# EAGLE design motordriver (EAGLE 5.10)
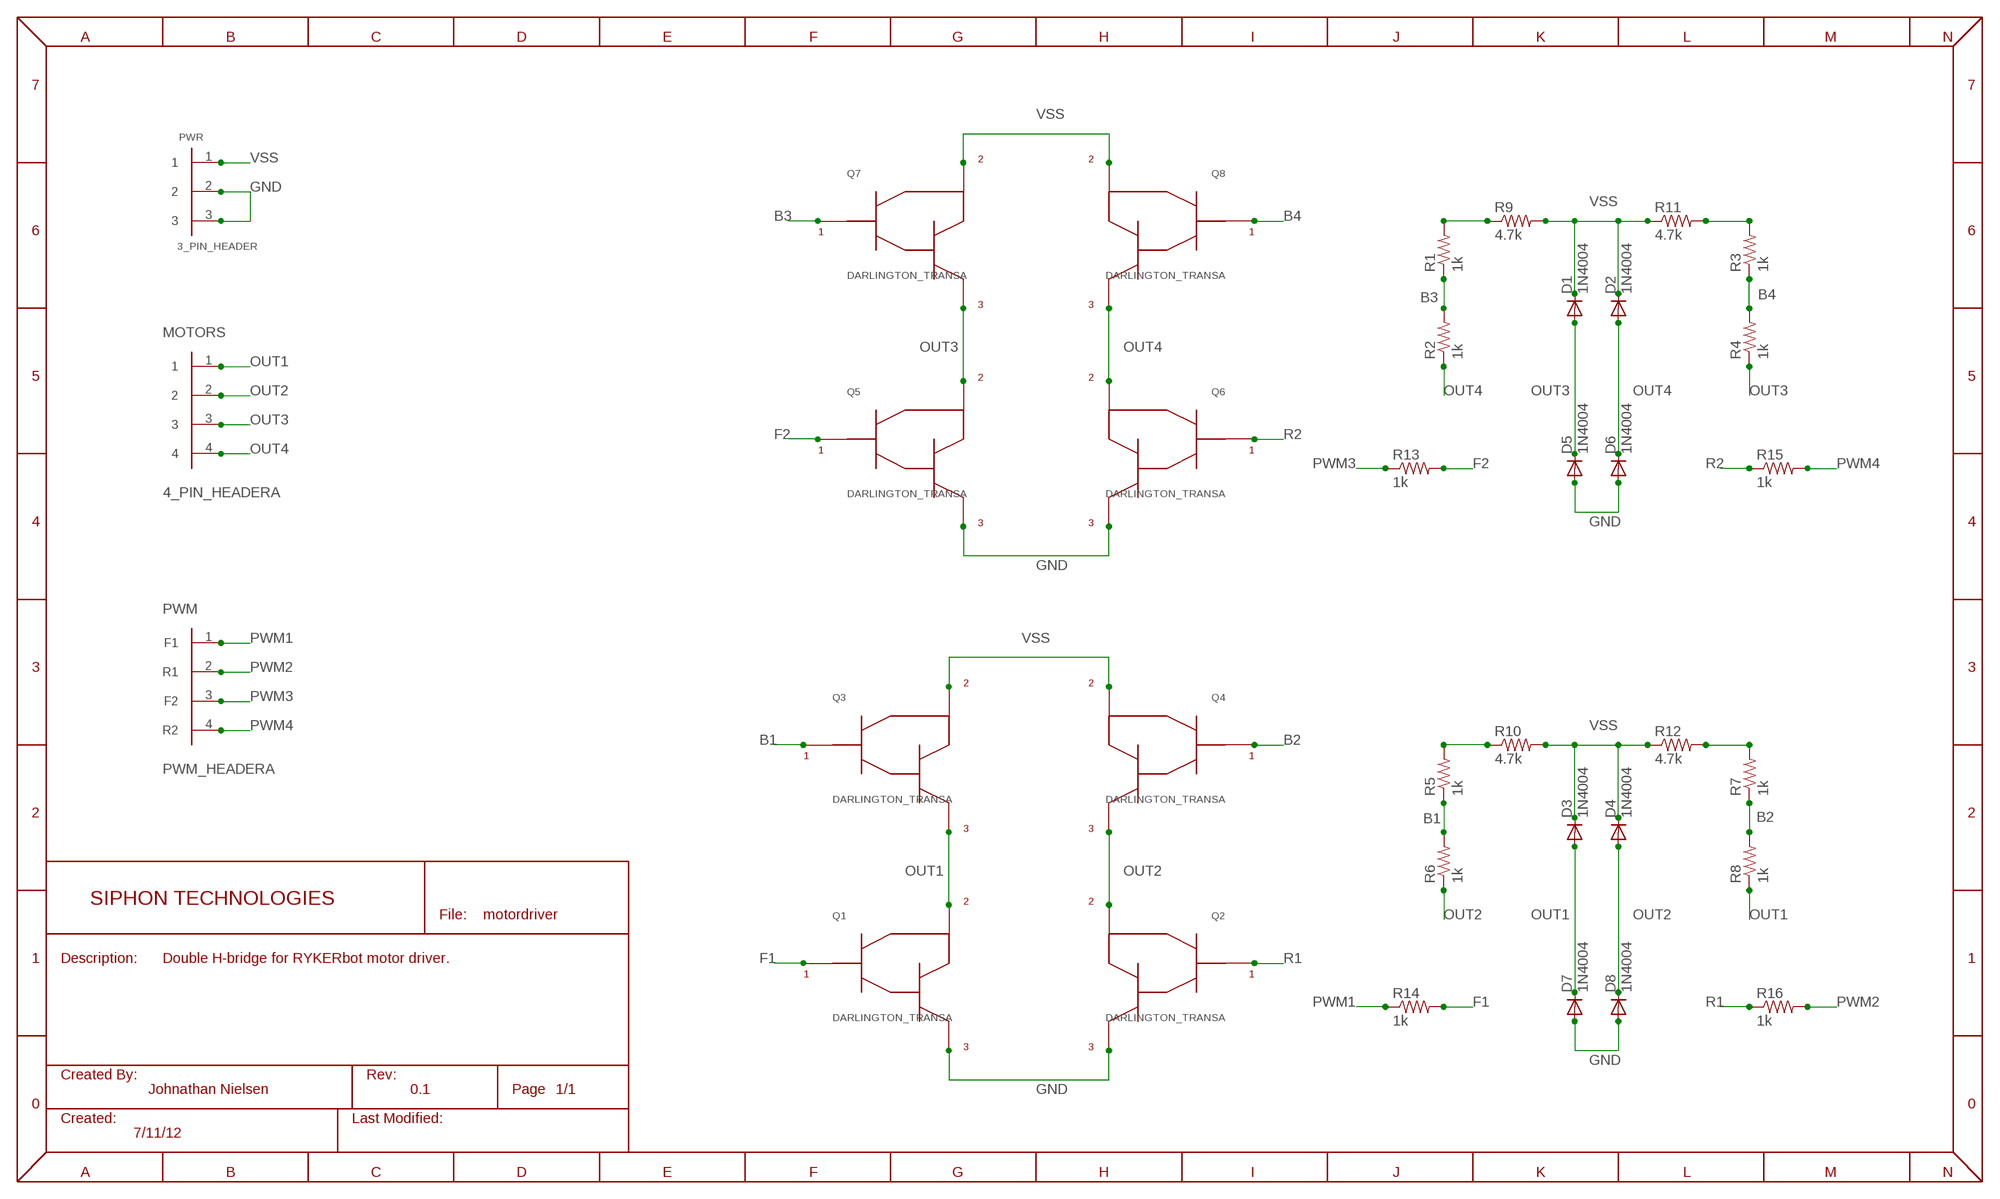
[diagram p0: schematic, sheet 1]

## Parts
D1  1N4004  [DO41-10]
D2  1N4004  [DO41-10]
D3  1N4004  [DO41-10]
D4  1N4004  [DO41-10]
D5  1N4004  [DO41-10]
D6  1N4004  [DO41-10]
D7  1N4004  [DO41-10]
D8  1N4004  [DO41-10]
MOTORS  4_PIN_HEADERA  [1X4MTA]
PWM  PWM_HEADERA  [1X4MTA]
PWR  3_PIN_HEADER  [1X3MTA]
Q1  DARLINGTON_TRANSA  [TO-220]
Q2  DARLINGTON_TRANSA  [TO-220]
Q3  DARLINGTON_TRANSA  [TO-220]
Q4  DARLINGTON_TRANSA  [TO-220]
Q5  DARLINGTON_TRANSA  [TO-220]
Q6  DARLINGTON_TRANSA  [TO-220]
Q7  DARLINGTON_TRANSA  [TO-220]
Q8  DARLINGTON_TRANSA  [TO-220]
R1  1k  R-US_0309/12  [0309/12]
R2  1k  R-US_0309/12  [0309/12]
R3  1k  R-US_0309/12  [0309/12]
R4  1k  R-US_0309/12  [0309/12]
R5  1k  R-US_0309/12  [0309/12]
R6  1k  R-US_0309/12  [0309/12]
R7  1k  R-US_0309/12  [0309/12]
R8  1k  R-US_0309/12  [0309/12]
R9  4.7k  R-US_0309/12  [0309/12]
R10  4.7k  R-US_0309/12  [0309/12]
R11  4.7k  R-US_0309/12  [0309/12]
R12  4.7k  R-US_0309/12  [0309/12]
R13  1k  R-US_0309/12  [0309/12]
R14  1k  R-US_0309/12  [0309/12]
R15  1k  R-US_0309/12  [0309/12]
R16  1k  R-US_0309/12  [0309/12]

## Nets
B1: Q3.B R5.1 R6.2
B2: Q4.B R7.1 R8.2
B3: Q7.B R1.1 R2.2
B4: Q8.B R3.1 R4.2
F1: Q1.B R14.2
F2: Q5.B R13.2
GND: D5.A D6.A D7.A D8.A PWR.2 PWR.3 Q1.E Q2.E Q5.E Q6.E
N$1: R1.2 R9.1
N$3: R5.2 R10.1
N$6: R3.2 R11.2
N$9: R7.2 R12.2
OUT1: D3.A D7.C MOTORS.1 Q1.C Q3.E R8.1
OUT2: D4.A D8.C MOTORS.2 Q2.C Q4.E R6.1
OUT3: D1.A D5.C MOTORS.3 Q5.C Q7.E R4.1
OUT4: D2.A D6.C MOTORS.4 Q6.C Q8.E R2.1
PWM1: PWM.1(F1) R14.1
PWM2: PWM.2(R1) R16.2
PWM3: PWM.3(F2) R13.1
PWM4: PWM.4(R2) R15.2
R1: Q2.B R16.1
R2: Q6.B R15.1
VSS: D1.C D2.C D3.C D4.C PWR.1 Q3.C Q4.C Q7.C Q8.C R9.2 R10.2 R11.1 R12.1

## Notes on the sheet
- Double H-bridge for RYKERbot motor driver.
- Johnathan Nielsen | 0.1
- 7/11/12

## Library data of the parts
D1-D8 = diode:1N4004: DIODE general purpose rectifier, 1 A
MOTORS = nielsen:4_PIN_HEADER: Generic 4 Pin Header
PWM = nielsen:PWM_HEADER: 4 Input Header
PWR = nielsen:3_PIN_HEADER: Generic 3 Pin Header
Q1-Q8 = nielsen:DARLINGTON_TRANS: NPN/PNP Darlington Pair Power Amp
R1-R16 = rcl:R-US_: RESISTOR, American symbol

## Board
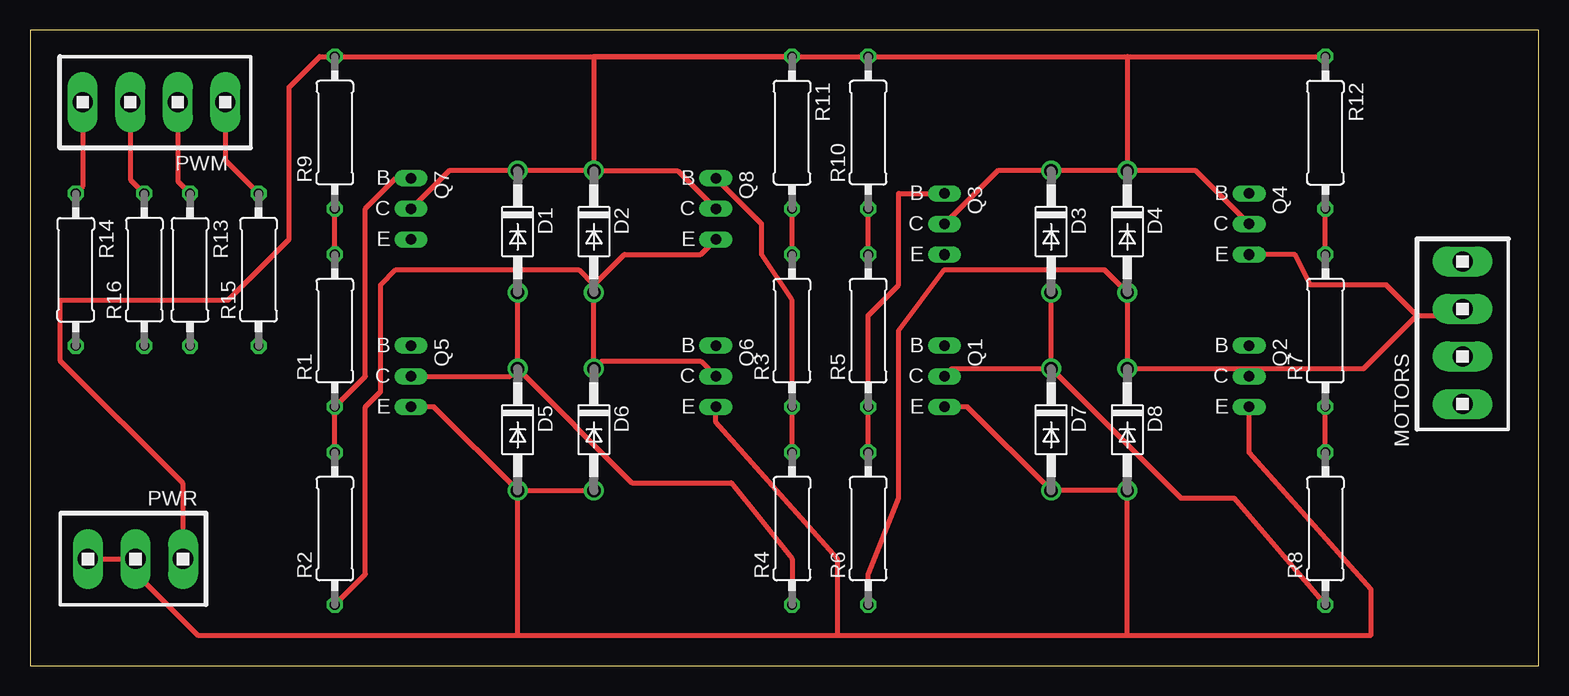
[diagram p1: board, top side]
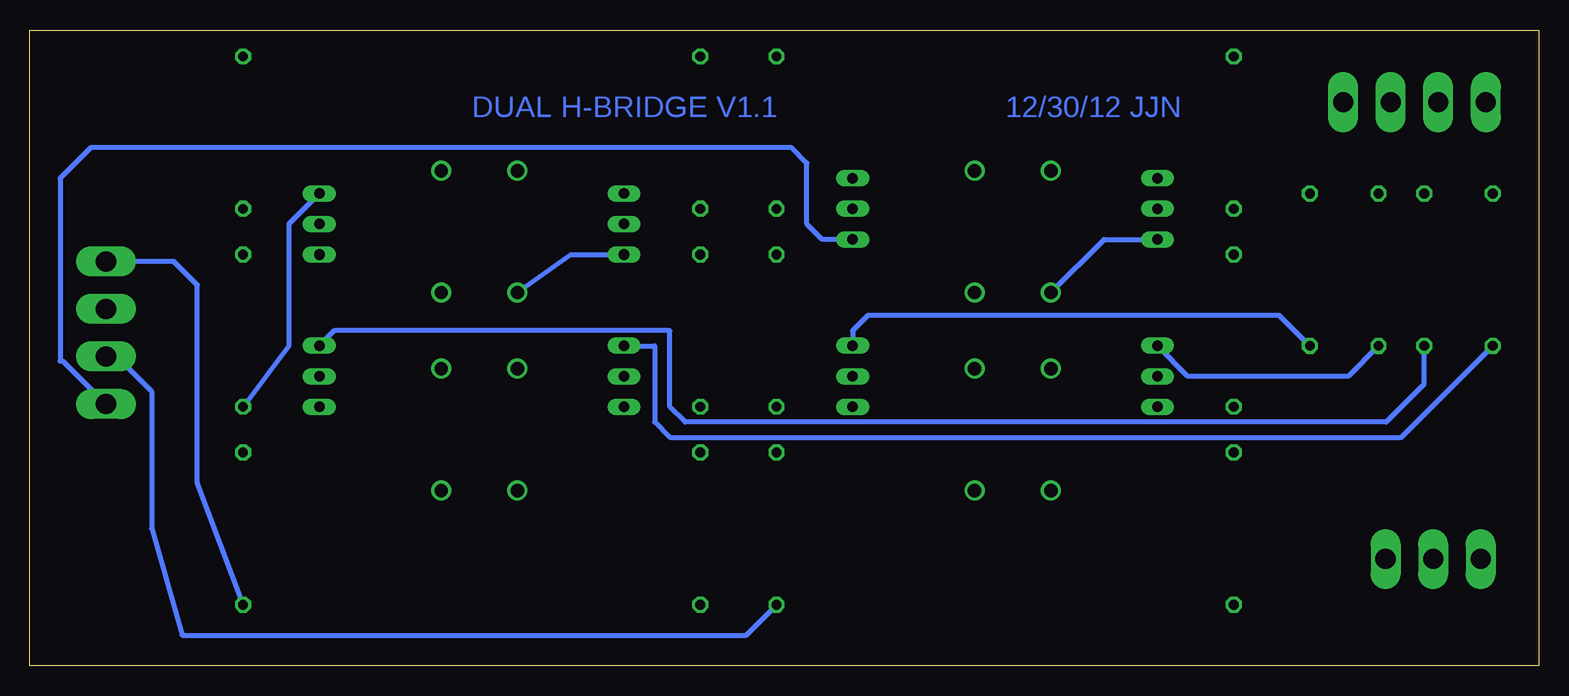
[diagram p2: board, bottom side, seen from below]

Size 125.71 x 53.01 mm. Coordinates in mm from the lower left corner, seen from the top.
Outline: 0,0 125.71,0 125.71,53.01 0,53.01 0,0
Copper layers (1*16): Top 0.035mm / dielectric 1.5mm / Bottom 0.035mm
Design rules "default *": minimum track width 16mil, minimum drill 24mil, track to track 10mil, track to pad 10mil, pad to pad 10mil, via to via 10mil, smd to smd 10mil, copper to edge 40mil, drill to drill 8mil, minimum pad ring 10mil, minimum via ring 8mil, stop-mask expansion 4mil, vias tented up to drill 0mil, thermal gap 10mil

### Footprints (pad centres in the part's own frame; a part is rotated, then mirrored left to right if it is on the bottom)
DO41-10 = drill 1.118 round: A 5.08,0; C -5.08,0
1X4MTA = drill 1.676 long: 1 -5.766,0; 2 -1.803,0; 3 2.159,0; 4 6.121,0
1X3MTA = drill 1.676 long: 1 -3.861,0; 2 0.102,0; 3 4.064,0
TO-220 = drill 0.88 long: B 0,-2.55; C 0,0; E 0,2.55
0309/12 = drill 0.813 octagon: 1 -6.35,0; 2 6.35,0

### Placement (x,y rotation side)
D1  40.64,36.2 270 top
D2  46.99,36.2 270 top
D3  85.09,36.2 270 top
D4  91.44,36.2 270 top
D5  40.64,19.68 270 top
D6  46.99,19.68 270 top
D7  85.09,19.68 270 top
D8  91.44,19.68 270 top
MOTORS  119.38,27.94 270 top
PWM  10.16,46.99 0 top
PWR  8.89,8.89 180 top
Q1  76.2,24.13 180 top
Q2  101.6,24.13 180 top
Q3  76.2,36.83 180 top
Q4  101.6,36.83 180 top
Q5  31.75,24.13 180 top
Q6  57.15,24.13 180 top
Q7  31.75,38.1 180 top
Q8  57.15,38.1 180 top
R1  25.4,27.94 90 top
R2  25.4,11.43 90 top
R3  63.5,27.94 90 top
R4  63.5,11.43 90 top
R5  69.85,27.94 90 top
R6  69.85,11.43 90 top
R7  107.95,27.94 90 top
R8  107.95,11.43 90 top
R9  25.4,44.45 90 top
R10  69.85,44.45 90 top
R11  63.5,44.45 270 top
R12  107.95,44.45 270 top
R13  13.34,33.02 270 top
R14  3.81,33.02 270 top
R15  19.05,33.02 90 top
R16  9.53,33.02 90 top

### Tracks (layer width: path | path; a pad name or v marks a point on that pad's centre or on a via)
B1
  Top 0.406: R6.2 R5.1 69.85,29.21 72.39,31.75 72.39,39.37 72.4,39.38 Q3.B
B2
  Top 0.406: R8.2 R7.1
  Bottom 0.406: Q4.B 104.14,36.83 104.14,26.67 R7.1
B3
  Top 0.406: R2.2 R1.1 27.94,24.13 27.94,38.1 30.49,40.65 Q7.B
B4
  Top 0.406: R4.2 R3.1 63.5,30.48 60.96,34.29 60.96,36.84 Q8.B
F1
  Bottom 0.406: Q1.B 73.66,26.67 73.66,20.32 72.39,19.05 11.43,19.05 R14.2
F2
  Bottom 0.406: R13.2 15.88,24.13 29.21,24.13 Q5.B
GND
  Top 0.406: D5.A D6.A | PWR.3 PWR.2 8.79,7.72 13.97,2.54 40.64,2.54 | 40.64,2.54 D5.A | Q5.E 33.66,21.58 D5.A | Q1.E 78.11,21.58 D7.A D8.A 91.44,2.54 | Q2.E 101.6,17.78 111.76,6.35 111.76,2.54 91.44,2.54 | Q6.E 57.15,20.32 67.31,8.89 67.31,2.54 | 67.31,2.54 91.44,2.54 | 40.64,2.54 67.31,2.54
N$1
  Top 0.406: R1.2 R9.1
N$3
  Top 0.406: R5.2 R10.1
N$6
  Top 0.406: R3.2 R11.2
N$9
  Top 0.406: R7.2 R12.2
OUT1
  Top 0.406: D7.C D3.A | D7.C 76.83,24.77 Q1.C | R8.1 100.33,13.97 95.89,13.97 D7.C
  Bottom 0.406: Q3.E 80.66,34.28 D3.A | MOTORS.1 113.72,33.71 111.76,31.75 111.76,15.24 R8.1
OUT2
  Top 0.406: 100.97,24.77 D8.C D4.A 89.53,33.02 76.2,33.02 72.39,27.94 72.39,13.97 69.85,7.62 R6.1 | 100.97,24.77 Q2.C | 100.97,24.77 111.12,24.77 115.57,29.21 | 115.57,29.21 118.85,29.21 MOTORS.2 | Q4.E 105.42,34.28 106.68,31.75 113.03,31.75 115.57,29.21
OUT3
  Top 0.406: D5.C D1.A | Q5.C 40.01,24.13 D5.C | R4.1 63.5,8.89 58.42,15.24 50.16,15.24 D5.C
  Bottom 0.406: Q7.E 36.2,35.55 D1.A | MOTORS.3 118.49,25.78 115.57,22.86 115.57,11.43 113.03,2.54 66.04,2.54 R4.1
OUT4
  Top 0.406: R2.1 27.94,7.62 27.94,21.59 29.21,22.86 29.21,31.75 30.48,33.02 45.72,33.02 46.99,31.75 | 46.99,31.75 D2.A D6.C 47.62,25.4 55.88,25.4 Q6.C | 46.99,31.75 49.53,34.29 55.88,34.29 Q8.E
  Bottom 0.406: MOTORS.4 122.96,25.4 123.19,25.4 123.19,40.64 120.65,43.18 62.23,43.18 60.96,41.91 60.96,36.83 59.68,35.55 Q8.E
PWM1
  Top 0.406: PWM.1 4.39,39.95 R14.1
PWM2
  Top 0.406: PWM.2 8.36,40.54 R16.2
PWM3
  Top 0.406: PWM.3 12.32,40.39 R13.1
PWM4
  Top 0.406: PWM.4 16.28,42.14 R15.2
R1
  Bottom 0.406: R16.1 9.53,23.5 12.7,20.32 71.12,20.32 72.39,21.59 72.39,27.94 100.34,27.94 Q2.B
R2
  Bottom 0.406: R15.1 21.59,29.21 55.88,29.21 57.15,27.94 Q6.B
VSS
  Top 0.406: R11.1 R9.2 24.13,50.8 21.59,48.26 21.59,35.56 16.51,30.48 2.54,30.48 2.54,25.4 12.75,15.19 PWR.1 | R11.1 R10.2 91.44,50.8 | D2.C D1.C 34.92,41.27 Q7.C | D4.C D3.C 80.64,41.27 Q3.C | D2.C 53.98,41.27 Q8.C | R11.1 46.99,50.8 D2.C | 91.44,50.8 R12.1 | 91.44,50.8 D4.C | Q4.C 97.16,41.27 D4.C

### Text on the board
Bottom: 12/30/12 JJN | DUAL H-BRIDGE V1.1